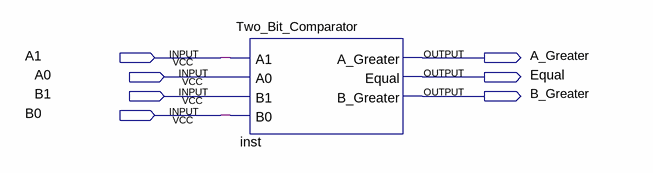
[diagram p0: schematic sheet]
// Quartus schematic Two_Bit_Comparator_Block.bdf as structural Verilog: 1 symbols, 7 pins
module Two_Bit_Comparator_Block (
  input  A1,
  input  A0,
  input  B1,
  input  B0,
  output A_Greater,
  output Equal,
  output B_Greater
);

  Two_Bit_Comparator inst (
    .A1(A1), .A0(A0), .B1(B1), .B0(B0), .A_Greater(A_Greater), .Equal(Equal), .B_Greater(B_Greater));
endmodule
